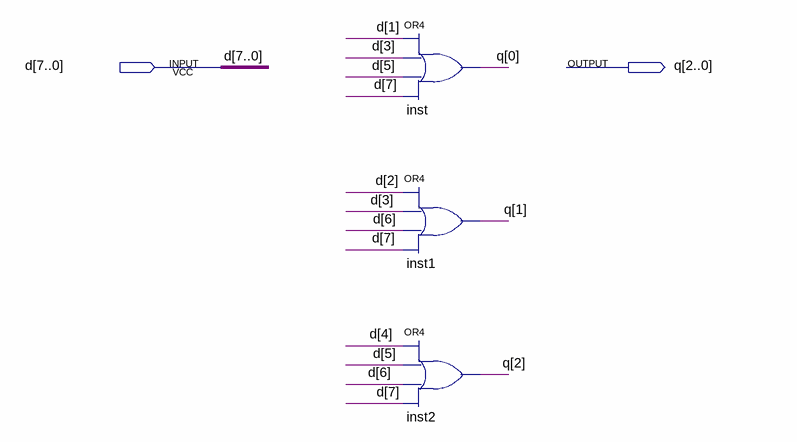
[diagram p0: schematic sheet]
// Quartus schematic 8to3encoder.bdf as structural Verilog: 3 symbols, 2 pins
module \8to3encoder  (
  input  [7:0] d,
  output [2:0] q
);

  or inst (q[0], d[1], d[3], d[5], d[7]);
  or inst1 (q[1], d[2], d[3], d[6], d[7]);
  or inst2 (q[2], d[4], d[5], d[6], d[7]);
endmodule
